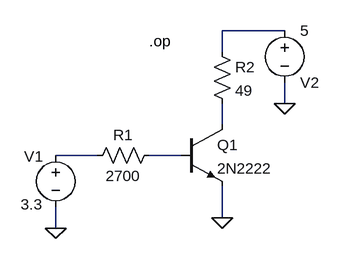
[diagram p0: schematic npn2.asc]
npn2.asc, the LTspice schematic file:
Version 4
SHEET 1 880 680
WIRE 272 -80 176 -80
WIRE 176 -48 176 -80
WIRE 272 32 272 0
WIRE 176 64 176 32
WIRE -16 112 -80 112
WIRE 112 112 64 112
WIRE 176 208 176 160
WIRE -80 224 -80 192
FLAG 176 208 0
FLAG -80 224 0
FLAG 272 32 0
SYMBOL res 160 -64 R0
SYMATTR InstName R2
SYMATTR Value 49
SYMBOL res 80 96 R90
WINDOW 0 0 56 VBottom 2
WINDOW 3 32 56 VTop 2
SYMATTR InstName R1
SYMATTR Value 2700
SYMBOL voltage -80 96 R0
WINDOW 0 -34 33 Bottom 2
WINDOW 3 -37 76 Top 2
WINDOW 123 0 0 Left 0
WINDOW 39 0 0 Left 0
SYMATTR InstName V1
SYMATTR Value 3.3
SYMBOL voltage 272 -96 R0
WINDOW 0 24 96 Left 2
WINDOW 3 24 16 Left 2
WINDOW 123 0 0 Left 0
WINDOW 39 0 0 Left 0
SYMATTR InstName V2
SYMATTR Value 5
SYMBOL npn 112 64 R0
SYMATTR InstName Q1
SYMATTR Value 2N2222
TEXT 64 -64 Left 2 !.op

The netlist it stands for:
* npn2.asc
R2 N001 N002 49
R1 N004 N003 2700
V1 N003 0 3.3
V2 N001 0 5
Q1 N002 N004 0 0 2N2222
.model NPN NPN
.model PNP PNP
.lib standard.bjt
.op
.backanno
.end